# EasyEDA schematic SCH_Sensor-Rudder_EasyEDA.json
TITLE: Rudder Position Sensor; REV: 1.0; Date: 2026-07-29; Sheet: 1/1; Drawn By: mromanini; Company: Scott and Marco
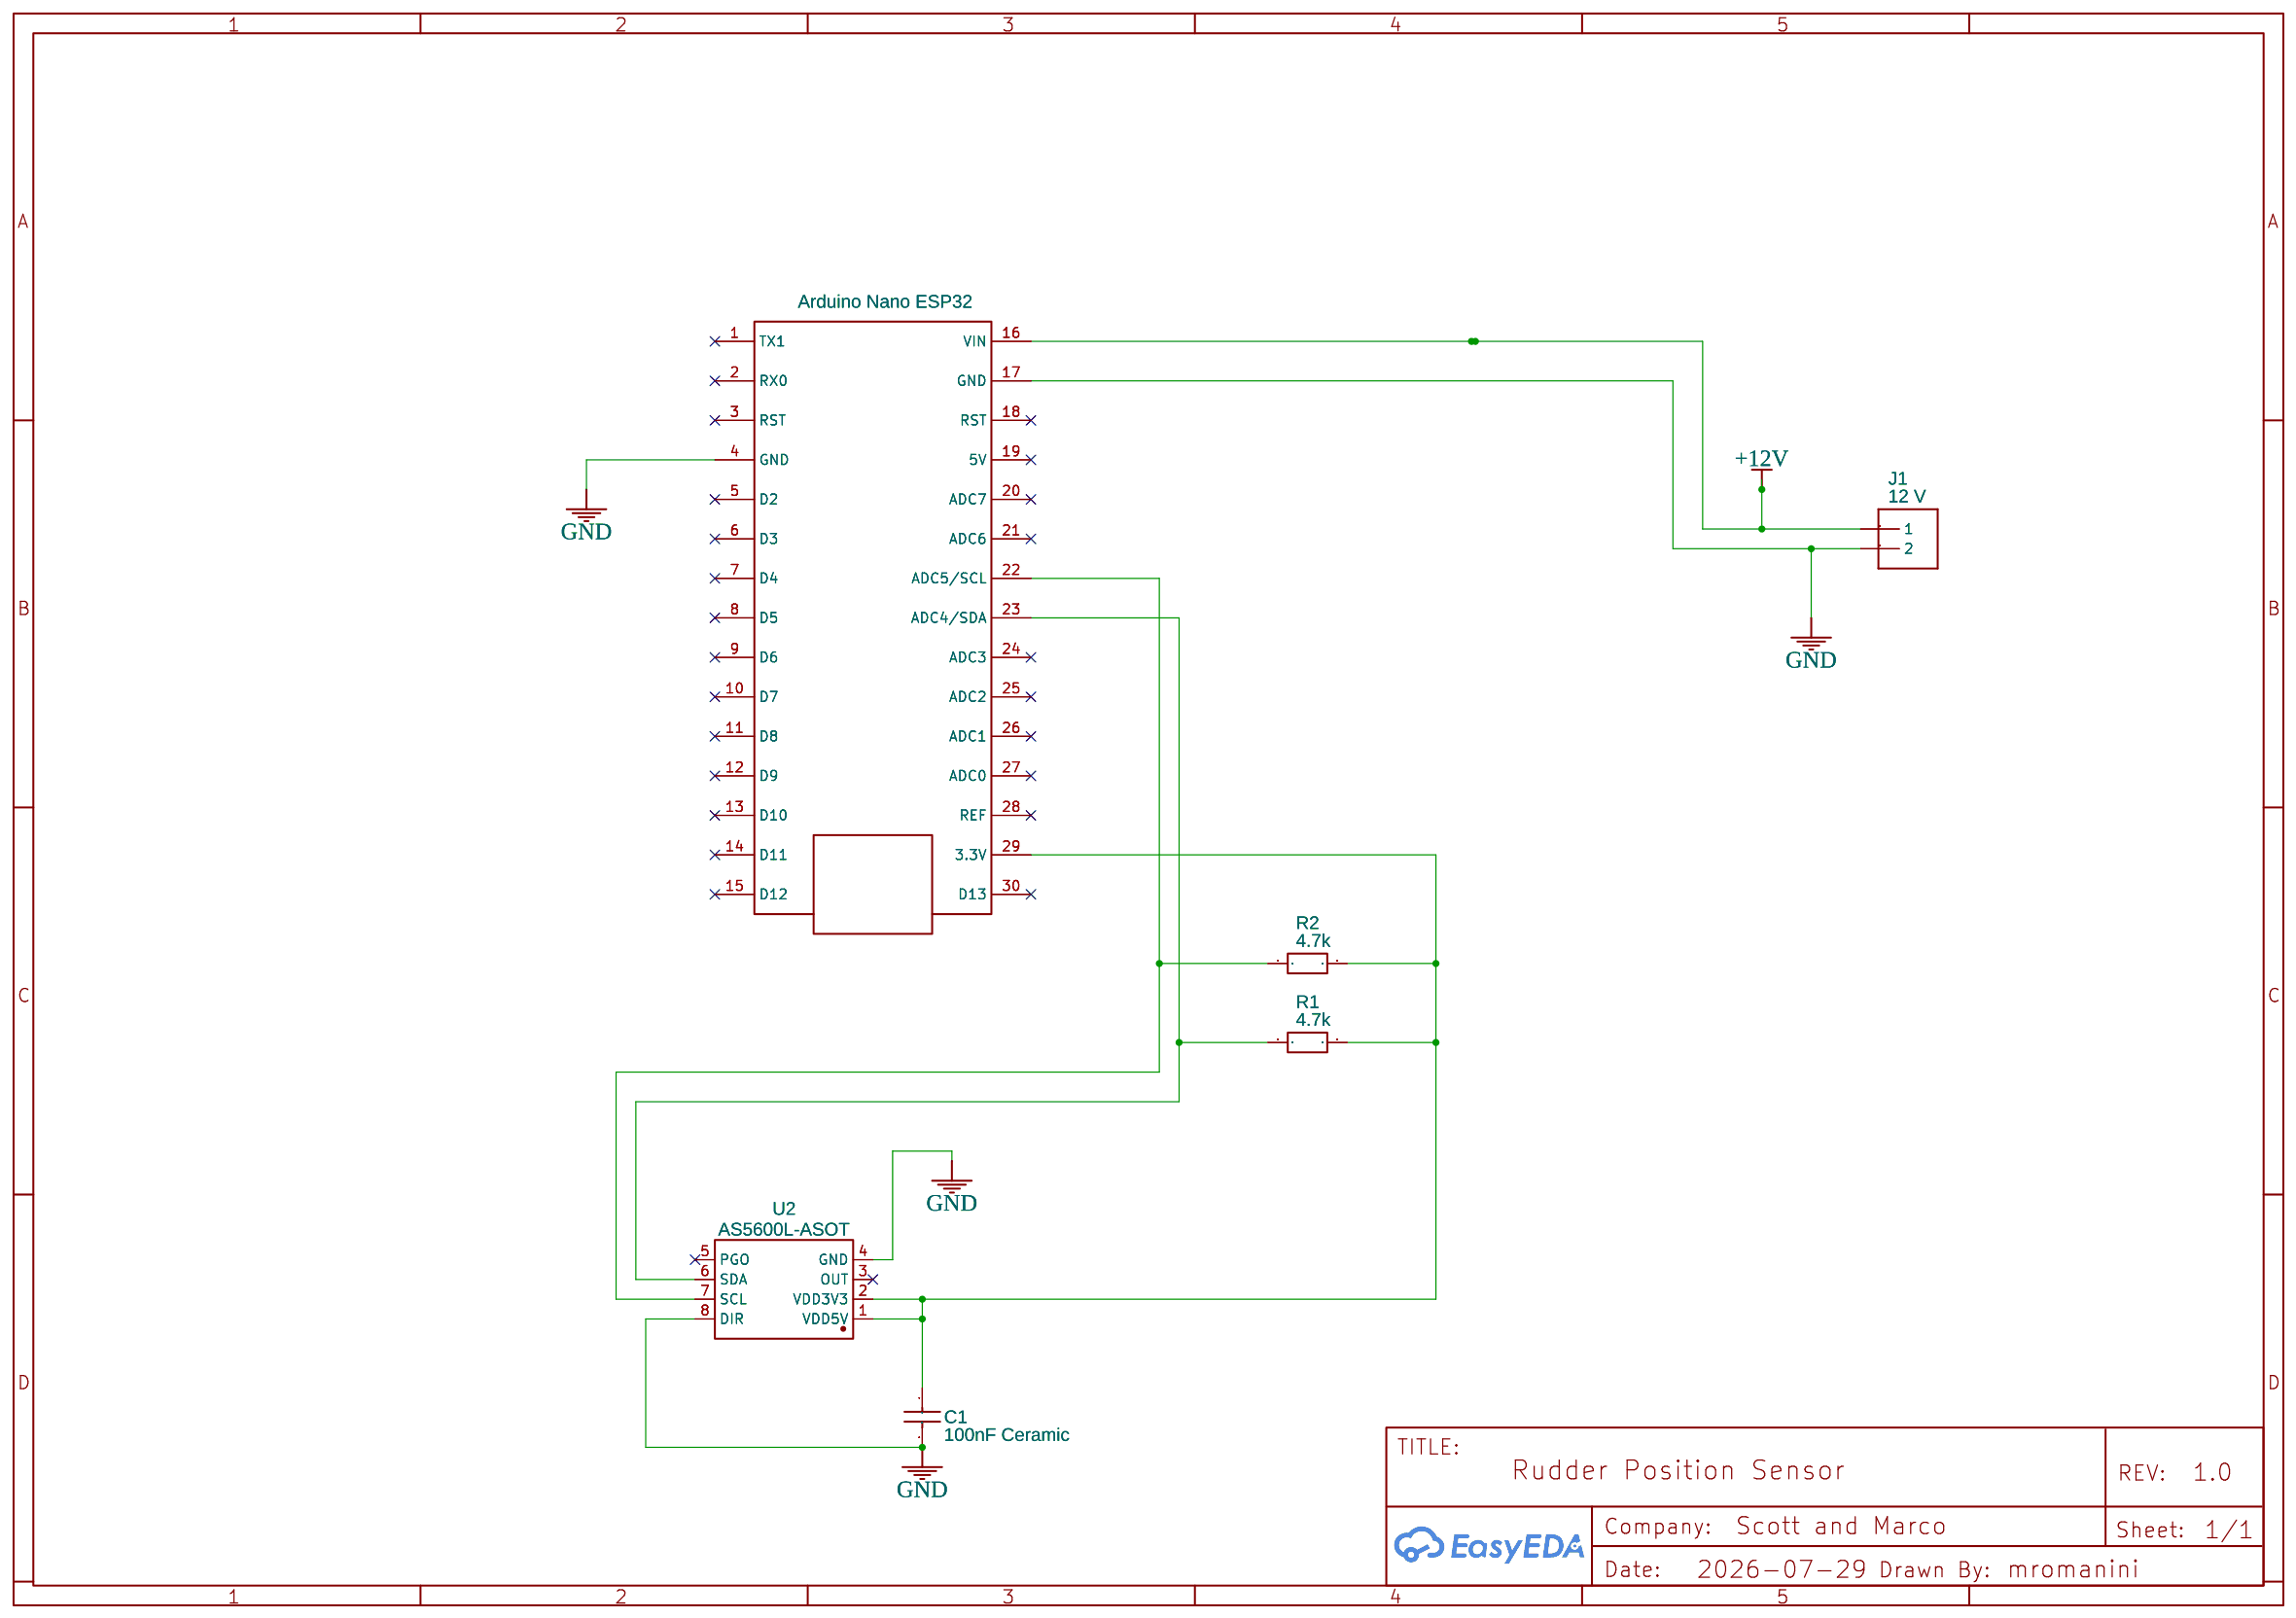
[diagram p0: schematic sheet]

## Parts
C1  100nF Ceramic  [CERAMIC CAPACITOR]
J1  12 V  [1X2-3.5MM]
R1  4.7k  [1K 0.25W]
R2  4.7k  [1K 0.25W]
U1  Arduino Nano ESP32  [ADUINO NANO R3]
U2  AS5600L-ASOT  [SOIC-8_L5.0-W4.0-P1.27-LS6.0-BL]

## Library data of the parts
C1 = Capacitor_Ceramic: Contributor: huuvinhz755
J1 = TERMBLOCK_1X2-3.5MM: Contributor: Adafruit
R1 R2 = 1w resistor: Contributor: Kagutsuchi
U1 = ARDUINO_NANO_R3: Contributor: Nikolay Yanev
U2 = AS5600L-ASOM: Supplier: LCSC; Supplier Part: C499458; Manufacturer: 美国AMS; Contributor: mromanini

## Nets
+12V: J1.1 U1.16(VIN)
GND: C1.2 J1.2 U1.4(GND) U1.17(GND) U2.4(GND) U2.8(DIR)
Net-(C1-1): C1.1 R1.2(1) R2.2(1) U1.29(3.3V) U2.1(VDD5V) U2.2(VDD3V3)
Net-(R1-1): R1.1(2) U1.23(ADC4/SDA) U2.6(SDA)
Net-(R2-1): R2.1(2) U1.22(ADC5/SCL) U2.7(SCL)

Not connected (* = marked no-connect by the designer): U1 1(TX1)* 2(RX0)* 3(RST)* 5(D2)* 6(D3)* 7(D4)* 8(D5)* 9(D6)* 10(D7)* 11(D8)* 12(D9)* 13(D10)* 14(D11)* 15(D12)* 18(RST)* 19(5V)* 20(ADC7)* 21(ADC6)* 24(ADC3)* 25(ADC2)* 26(ADC1)* 27(ADC0)* 28(REF)* 30(D13)*; U2 3(OUT)* 5(PGO)*
